# Altium schematic sheet BOARD4.SchDoc
size A3
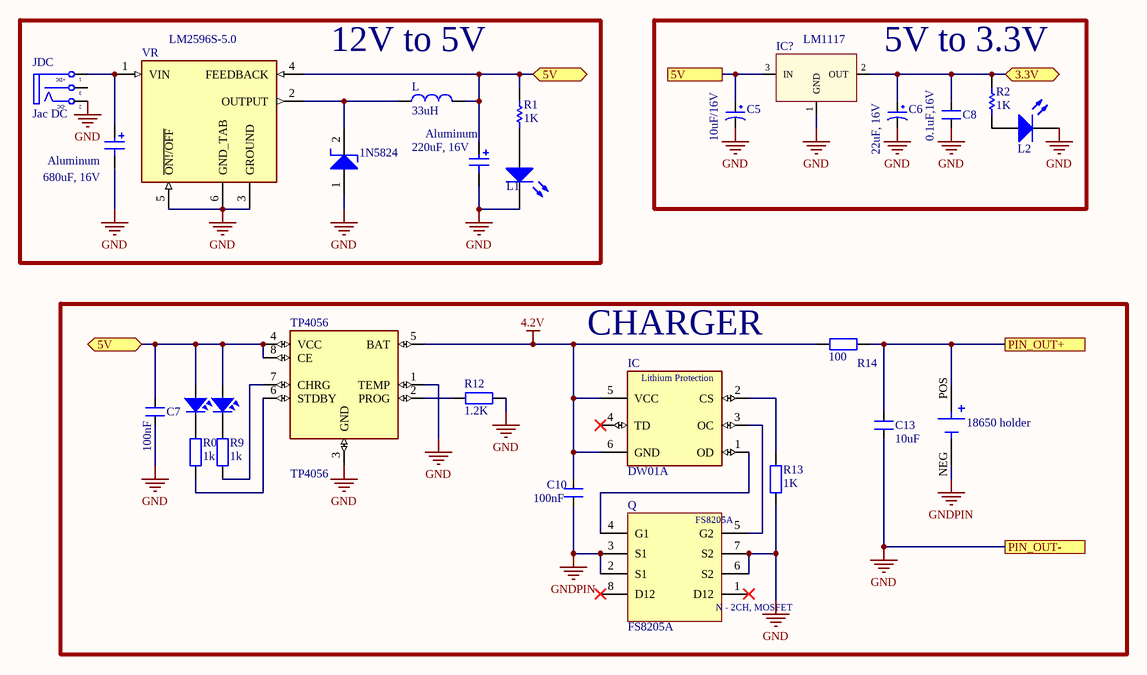
[diagram p0: BOARD4.SchDoc]

## Parts
1N5824  Diode  [SOD-3232F_]  (value not drawn)
220uF,_16V  Aluminum  [CAPAE1030X1000N]
680uF,_16V  Aluminum  [CAPAE1030X1000N]
?  18650 holder  [BAT_BK-18650-PC2]
C5  10uF/16V  [CP1/2]
C6  22uF, 16V  [CP1/2]
C7  100nF  [SM-CAP-0805]
C8  0.1uF,16V  [SM-CAP-0805]
C10  100nF  [SM-CAP-0805]
C13  10uF  [SM-CAP-0805]
IC  DW01A  [SOT23-6]
IC?  LM1117  [SOT223-4N]
JDC  Jac DC  [DC-IN]
L  value 33uH  [R1/2W]  (hidden comment: Inductor Iron)
L1  LED  [LED-5-RED]  (value not drawn)
L2  LED  [LED-5-BLUE]  (value not drawn)
LED  LED SMD  [SM-LED-0805-Blue]  (value not drawn)
LED20  LED SMD  [SM-LED-0805-Blue]  (value not drawn)
Q  FS8205A  [SOP65P640X120-8N]
R0  1k  [SM-RES-0805]
R1  value 1K  [SM-RES-0805]  (hidden comment: Res1)
R2  value 1K  [SM-RES-0805]  (hidden comment: Res1)
R9  1k  [SM-RES-0805]
R12  1.2K  [SM-RES-0805]
R13  1K  [SM-RES-0805]
R14  100  [SM-RES-0805]
TP4056  TP4056  [SOP-8]
VR  LM2596S-5.0  [TO170P1524X483-6N]

## Blocks framed on the sheet
12V to 5V: 1N5824 220uF,_16V 680uF,_16V JDC L L1 R1 VR
5V to 3.3V: C5 C6 C8 IC? L2 R2
CHARGER: ? C7 C10 C13 IC LED LED20 Q R0 R9 R12-R14 TP4056

## Ports
3.3V (bidir), 5V, 5V (bidir), PIN_OUT+, PIN_OUT-

## Nets
4.2V: C10.2 IC.5(VCC) IC.6(GND) R14.1 TP4056.5(BAT)
GND: 1N5824.1(A) 220uF,_16V.2 680uF,_16V.2 C5.2 C6.2 C7.1 C8.1 C13.1 IC?.1(GND) JDC.2(TN) L1.2(K) L2.2(K) Q.6(S2) Q.7(S2) R12.2 R13.1 TP4056.1(TEMP) TP4056.3(GND) VR.3(GROUND) VR.5(~{ON!/OFF}) VR.6(GND_TAB) ; port PIN_OUT-
GNDPIN: ?.NEG C10.1 Q.2(S1) Q.3(S1)
3.3V: C6.1 C8.2 IC?.2(OUT) R2.1 ; port 3.3V
5V: 220uF,_16V.1 C5.1 C7.2 IC?.3(IN) L.2 LED.1 LED20.1 R1.1 TP4056.4(VCC) TP4056.8(CE) VR.4(FEEDBACK) ; port 5V
PIN_OUT+: ?.POS C13.2 R14.2 ; port PIN_OUT+
Net1N5824_2: 1N5824.2(K) L.1 VR.2(OUTPUT)
Net680uF,_16V_1: 680uF,_16V.1 JDC.1(T) VR.1(VIN)
NetIC_1: IC.1(OD) Q.4(G1)
NetIC_2: IC.2(CS) R13.2
NetIC_3: IC.3(OC) Q.5(G2)
NetL1_1: L1.1(A) R1.2
NetL2_1: L2.1(A) R2.2
NetLED20_2: LED20.2 R0.2
NetLED_2: LED.2 R9.2
NetR0_1: R0.1 TP4056.6(STDBY)
NetR9_1: R9.1 TP4056.7(CHRG)
NetR12_1: R12.1 TP4056.2(PROG)

Not connected (* = marked no-connect by the designer): IC 4(TD)*; JDC 3(S); Q 1(D12)* 8(D12)*

## Notes on the sheet
- Title
- Size:
- Date:
- A3
- Number:
- Time:
- Revision:
- Sheet
- of
- File:
- (in symbol DCIN) +DC; -DC
- (in symbol DW01A) Lithium Protection
- (in symbol FS8205A) N - 2CH, MOSFET

## Library data of the parts
1N5824 = DIODE schottky: Default Diode SMD; Code - JEDEC: DO-214-AB; Value: 1N5007; Published: 8-Jun-2000; Revision: July-2002: Re-released for DXP Platform.; Publisher: Altium Limited
220uF,_16V 680uF,_16V = Aluminum_Capacitor: 680µF 16V
? = 18650: Battery Holder (Open) 18650 1 Cell PC Pin; MF: Greenlee Communications; MP: 18650; Value: *; SnapEDA_Link: https://www.snapeda.com/parts/18650/Greenlee%20Communications/view-part/2890243/?ref=snap; Price: None; Package: None; Availability: Unavailable
C5 C6 = CP1: Cap P  0,1uF < 22uF , 16 - 50V; Value: 10uF/50V; Description 1: 10 => 220uF/6,3V/10V - 10uF => 100uF/16V; Description 2: 0,1uF => 33uF/50V - 10uF => 22uF/63V; Description 3: 0,47uF => 10uF/100V
C7 C8 C10 C13 = CM: Cap SMD; Value: 103
IC = DW01A: Pushbutton Switch SPST-NC Standard Panel Mount, Front; MF: Fortune Semiconductor; Price: None; Availability: Unavailable; Package: Package Analog Devices; SnapEDA_Link: https://www.snapeda.com/parts/DW01A/Fortune%20Semiconductor/view-part/4388554/?ref=snap; MP: DW01A; Value: *
IC? = LM1117: Available in 1.8V, 2.5V, 2.85V, 3.3V, 5V, and  Adjustable Versions,lm1117mp; Value: LM317
JDC = DCIN: Jac DC input; Value: Jac DC
L = Inductor Iron: Magnetic-Core Inductor; Manufacturer: Generic Components; Class: Passive; Published: 1999; SubClass: Inductor
L1 L2 = LED: Typical LED; Published: 8-Jun-2000; LatestRevisionDate: 08-Jul-2005; LatestRevisionNote: Mech Layer 1 removed.; PackageReference: LED-1; Publisher: Altium Limited
LED LED20 = LED-SMD-0805
Q = FS8205A: N/A; MF: Fortune Semiconductor; Value: *; Price: None; Package: Package Analog Devices; SnapEDA_Link: https://www.snapeda.com/parts/FS8205A/Fortune%20Semiconductor/view-part/3217108/?ref=snap; Availability: Unavailable; MP: FS8205A
R0 R9 R13 = RM: Resistor SMD; Value: 1K
R1 R2 = Res1_1: Resistor; Manufacturer: Generic Components; Class: Passive; Published: 08/06/2000; Publisher: Altium Hobart Technology Centre; SubClass: Resistor
R12 R14 = RM: Resistor SMD; Value: 1K
TP4056 = TP4056: Complete single cell Li-Ion battery with a constant current / constant voltage linear charger; MF: NanJing Top Power ASIC Corp.; Package: Package Analog Devices; MP: TP4056; Value: *; SnapEDA_Link: https://www.snapeda.com/parts/TP4056%20/NanJing%20Top%20Power%20ASIC%20Corp./view-part/2888426/?ref=snap; Price: None; Availability: Unavailable
VR = LM2596S-5.0: SIMPLE SWITCHER&reg; 4.5V to 40V, 3A Low Component Count Step-Down Regulator 5-DDPAK/TO-263; MF: Texas Instruments; MP: LM2596S-5.0/NOPB; DigiKey-Purchase-URL: https://snapeda.com/shop?store=DigiKey&id=15588; Mouser-Purchase-URL: https://snapeda.com/shop?store=Mouser&id=15588; SnapEDA_Link: https://www.snapeda.com/parts/LM2596S-5.0/NOPB/Texas%20Instruments/view-part/15588/?ref=snap; Price: None; Value: *; Availability: Good; Texas_Instruments-Purchase-URL: https://snapeda.com/shop?store=Texas+Instruments&id=15588; Package: TO-263-5 Texas Instruments